# EAGLE design msp430_cool (EAGLE 6.5.0)
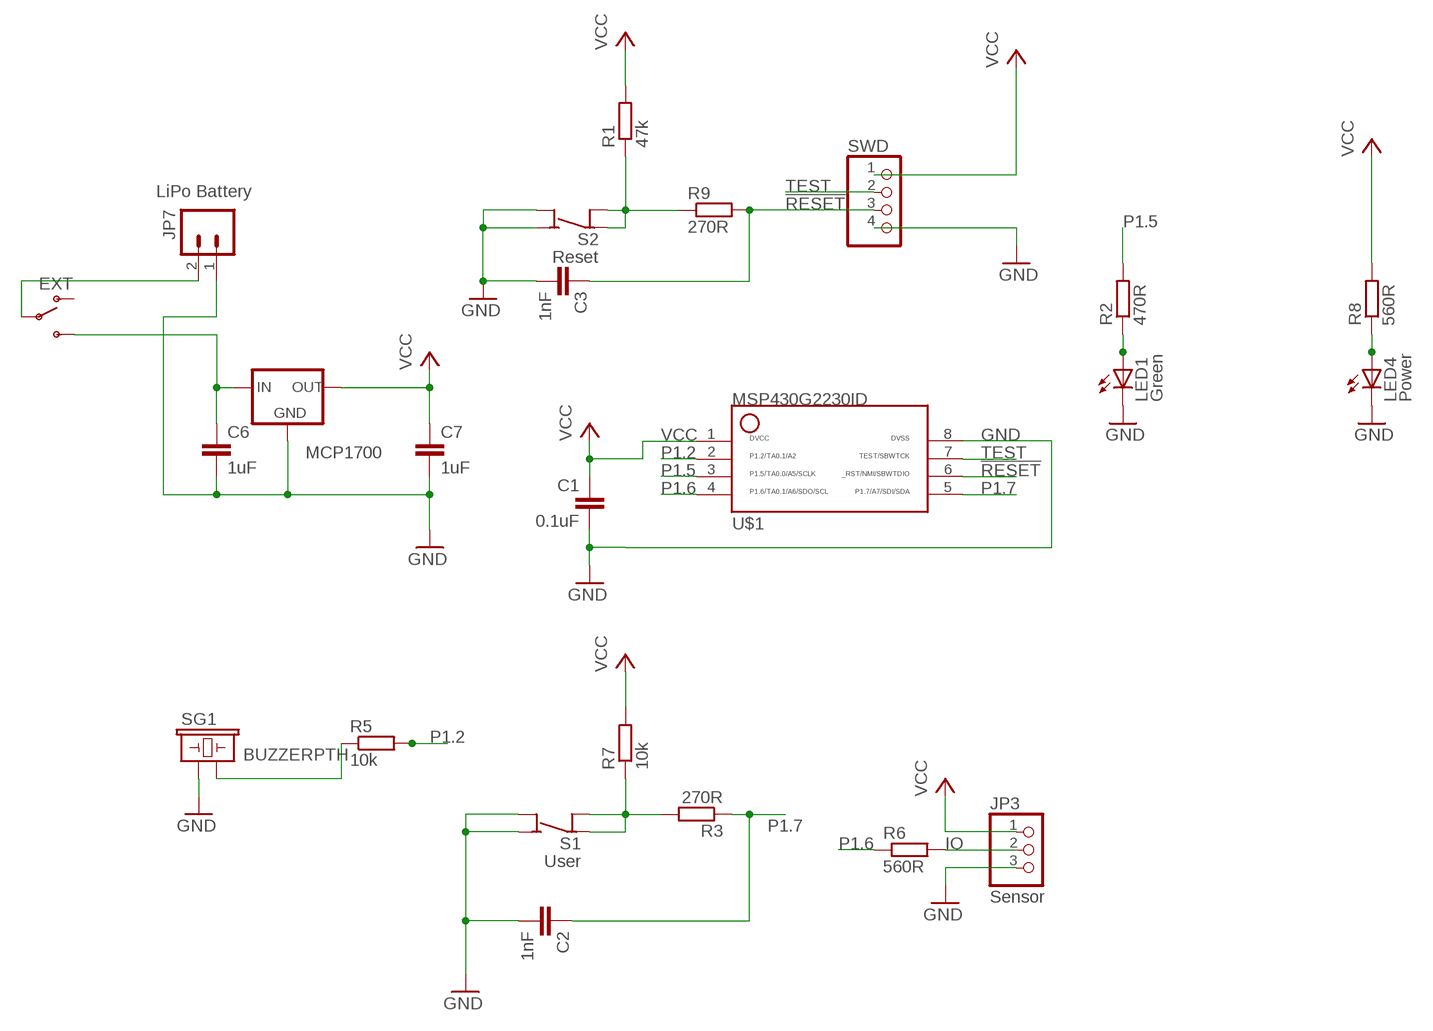
[diagram p0: schematic, sheet 1]

## Parts
C1  0.1uF  C-EUC0805  [C0805]
C2  1nF  C-EUC0805  [C0805]
C3  1nF  C-EUC0805  [C0805]
C6  1uF  C-EUC0805  [C0805]
C7  1uF  C-EUC0805  [C0805]
JP3  Sensor  PINHD-1X3  [1X03]
JP7  LiPo Battery  M02JST-PTH-2  [JST-2-PTH]
LED1  Green  LEDCHIPLED_1206  [CHIPLED_1206]
LED4  Power  LEDCHIPLED_1206  [CHIPLED_1206]
MCP1700  MCP1700  MCP1700SOT-23  [SOT-23]
ON  EXT  SWITCH-SPSTPTH  [SWITCH-SPDT]
R1  47k  R-EU_R0805  [R0805]
R2  470R  R-EU_R0805  [R0805]
R3  270R  R-EU_R0805  [R0805]
R5  10k  R-EU_R0805  [R0805]
R6  560R  R-EU_R0805  [R0805]
R7  10k  R-EU_R0805  [R0805]
R8  560R  R-EU_R0805  [R0805]
R9  270R  R-EU_R0805  [R0805]
S1  User  SPST4  [6MMTACTILE_4PIN]
S2  Reset  SPST4  [6MMTACTILE_4PIN]
SG1  BUZZERPTH  [BUZZER-12MM]
SWD  PINHD-1X4  [1X04]
U$1  MSP430G2230ID  [SO08]

## Nets
!RESET: C3.1 R9.2 SWD.3 U$1.6
GND [GND]: C1.2 C2.2 C3.2 C6.2 C7.2 JP3.3 JP7.1 LED1.C LED4.C MCP1700.1(GND) S1.A1(NO) S1.A2(NO) S2.A1(NO) S2.A2(NO) SG1.+ SWD.4 U$1.8
IO: JP3.2 R6.2
N$2: LED4.A R8.1
N$3 [VCC]: JP7.2 ON.2(P)
N$4: LED1.A R2.1
N$5: R1.1 R9.1 S2.B1(COM) S2.B2(COM)
N$6: R5.1 SG1.-
N$7: R3.2 R7.1 S1.B1(COM) S1.B2(COM)
N$15 [VCC]: C6.1 MCP1700.3(IN) ON.3(S)
P1.2: R5.2 U$1.2
P1.5: R2.2 U$1.3
P1.6: R6.1 U$1.4
P1.7: C2.1 R3.1 U$1.5
TEST: SWD.2 U$1.7
VCC [VCC]: C1.1 C7.1 JP3.1 MCP1700.2(OUT) R1.2 R7.2 R8.2 SWD.1 U$1.1
Unconnected: ON.1(O)

## Library data of the parts
C1-C3 C6 C7 = resistor:C-EU: CAPACITOR, European symbol
JP3 = pinhead:PINHD-1X3: PIN HEADER
JP7 = SparkFun:M02: Header 2 Standard 2-pin 0.1" header. Use with straight break away headers (SKU : PRT-00116), right angle break away headers (PRT-00553), swiss pins (PRT-00743), machine pins (PRT-00117), and female headers (PRT-00115). Molex polarized connector foot print use with SKU : PRT-08233 with associated crimp pins and housings.
LED1 LED4 = adafruit:LED: LED OSRAM: - CHIPLED LG R971, LG N971, LY N971, LG Q971, LY Q971, LO R971, LY R971 LH N974, LH R974 LS Q976, LO Q976, LY Q976 LO Q996 - Hyper CHIPLED LW Q18S LB Q993, LB Q99A, LB R99A - SideLED LS A670, LO A670, LY A670, LG A670, LP A670 LB A673, LV A673, LT A673, LW A673 LH A674 LY A675 LS A676, LA A676, LO A676, LY A676, LW A676 LS A679, LY A679, LG A679 - Hyper Micro SIDELED® LS Y876, LA Y876, LO Y876, LY Y876 LT Y87S - SmartLED LW L88C, LW L88S LB L89C, LB L89S, LG L890 LS L89K, LO L89K, LY L89K LS L896, LA L896, LO L896, LY L896 - TOPLED LS T670, LO T670, LY T670, LG T670, LP T670 LSG T670, LSP T670, LSY T670, LOP T670, LYG T670 LG T671, LOG T671, LSG T671 LB T673, LV T673, LT T673, LW T673 LH T674 LS T676, LA T676, LO T676, LY T676, LB T676, LH T676, LSB T676, LW T676 LB T67C, LV T67C, LT T67C, LS T67K, LO T67K, LY T67K, LW E67C LS E67B, LA E67B, LO E67B, LY E67B, LB E67C, LV E67C, LT E67C LW T67C LS T679, LY T679, LG T679 LS T770, LO T770, LY T770, LG T770, LP T770 LB T773, LV T773, LT T773, LW T773 LH T774 LS E675, LA E675, LY E675, LS T675 LS T776, LA T776, LO T776, LY T776, LB T776 LHGB T686 LT T68C, LB T68C - Hyper Mini TOPLED® LB M676 - Mini TOPLED Santana® LG M470 LS M47K, LO M47K, LY M47K Source: http://www.osram.convergy.de/
MCP1700 = MY_IC:MCP1700
ON = SparkFun:SWITCH-SPST: SPST Switch Simple slide switch. Spark Fun Electronics SKU : COM-00102
R1-R3 R5-R9 = resistor:R-EU_: RESISTOR, European symbol
S1 S2 = mes_electromech:SPST4: SPST switch with 2 pins per contact
SG1 = SparkFun:BUZZER: Buzzer 12mm Spark Fun Electronics SKU : Comp-Buzzer
SWD = pinhead:PINHD-1X4: PIN HEADER
U$1 = thierry_eagle:MSP430G2230ID

## Net classes
0 default: width 0.305 mm, drill 0.508 mm
1 GND: width 0.508 mm, drill 0.508 mm
2 VCC: width 0.508 mm, drill 0.508 mm

## Board
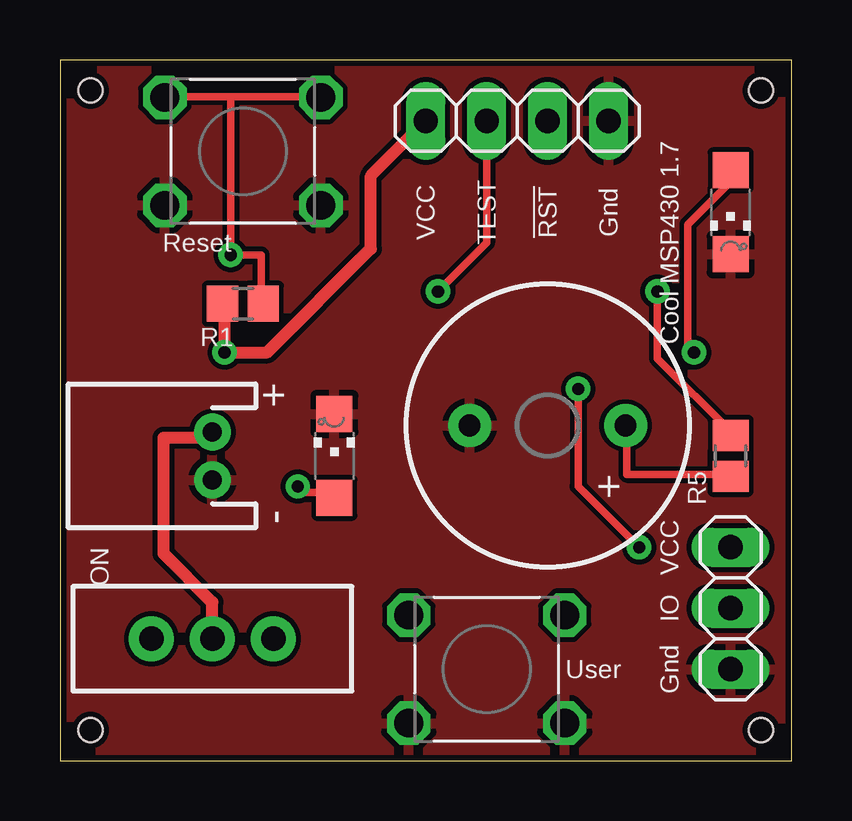
[diagram p1: board, top side]
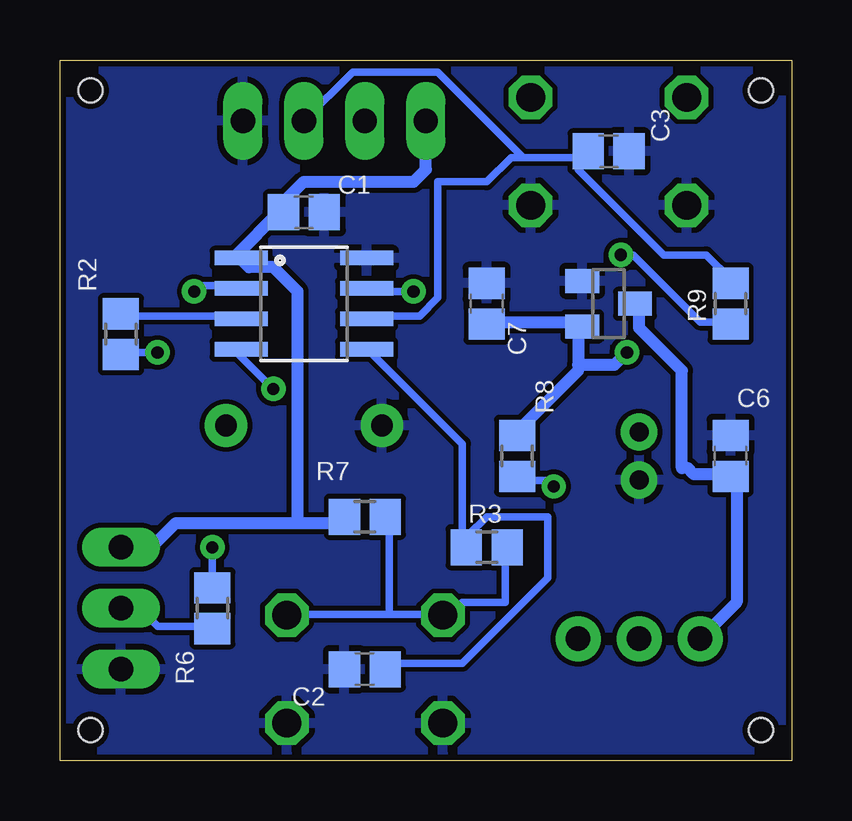
[diagram p2: board, bottom side, seen from below]

Size 30.48 x 29.21 mm. Coordinates in mm from the lower left corner, seen from the top.
Outline: 0,0 30.48,0 30.48,29.21 0,29.21 0,0
Copper layers (1*16): Top 0.035mm / dielectric 1.5mm / Bottom 0.035mm
Design rules "SparkFun *": minimum track width 12mil, minimum drill 20mil, track to track 8mil, track to pad 8mil, pad to pad 8mil, via to via 8mil, smd to smd 8mil, copper to edge 10mil, drill to drill 8mil, minimum pad ring 12mil, minimum via ring 10mil, stop-mask expansion 4mil, vias tented up to drill 25mil, thermal gap 10mil
Holes 1 mm at 1.27,1.27 1.27,27.94 29.21,1.27 29.21,27.94

### Footprints (pad centres in the part's own frame; a part is rotated, then mirrored left to right if it is on the bottom)
C0805 = smd 1.3 x 1.5: 1 -0.85,0; 2 0.85,0
1X03 = drill 1.016 long: 1 -2.54,0; 2 0,0; 3 2.54,0
JST-2-PTH = drill 0.787 pad 1.524: 1 -1,0; 2 1,0
CHIPLED_1206 = smd 1.5 x 1.5: A 0,-1.75; C 0,1.75
SOT-23 = smd 1 x 1.4: 1 -0.95,-1.1; 2 0.95,-1.1; 3 0,1.1
SWITCH-SPDT = drill 1.016 pad 1.88: 1 0,2.54; 2 0,0; 3 0,-2.54
R0805 = smd 1.3 x 1.5: 1 -0.85,0; 2 0.85,0
6MMTACTILE_4PIN = drill 1.2 octagon: A1 3.25,-2.25; A2 -3.25,-2.25; B1 3.25,2.25; B2 -3.25,2.25
BUZZER-12MM = drill 0.9 pad 1.778: + 3.25,0; - -3.25,0
1X04 = drill 1.016 long: 1 -3.81,0; 2 -1.27,0; 3 1.27,0; 4 3.81,0
SO08 = smd 0.61 x 2.21: 1 -1.905,-2.616; 2 -0.635,-2.616; 3 0.635,-2.616; 4 1.905,-2.616; 5 1.905,2.616; 6 0.635,2.616; 7 -0.635,2.616; 8 -1.905,2.616

### Placement (x,y rotation side)
C1  20.32,22.86 0 bottom
C2  17.78,3.81 180 bottom
C3  7.62,25.4 0 bottom
C6  2.54,12.7 90 bottom
C7  12.7,19.05 90 bottom
JP3  27.94,6.35 270 top
JP7  6.35,12.7 90 top
LED1  27.94,22.86 180 top
LED4  11.43,12.7 0 top
MCP1700  7.62,19.05 270 bottom
ON  6.35,5.08 270 top
R1  7.62,19.05 180 top
R2  27.94,17.78 90 bottom
R3  12.7,8.89 0 bottom
R5  27.94,12.7 90 top
R6  24.13,6.35 270 bottom
R7  17.78,10.16 180 bottom
R8  11.43,12.7 90 bottom
R9  2.54,19.05 90 bottom
S1  17.78,3.81 0 top
S2  7.62,25.4 0 top
SG1  20.32,13.97 180 top
SWD  19.05,26.67 0 top
U$1  20.32,19.05 270 bottom

### Tracks (layer width: path | path; a pad name or v marks a point on that pad's centre or on a via)
!RESET
  Bottom 0.305: 8.89,25.15 8.89,25.4 C3.1 8.89,25.15 | 8.89,25.15 8.89,24.64 5.33,21.08 3.56,21.08 2.54,20.07 R9.2 | 8.89,25.15 11.18,25.15 | 11.18,25.15 11.68,25.15 12.7,24.13 14.73,24.13 14.73,19.3 15.49,18.54 17.53,18.54 U$1.6 | SWD.3 18.29,28.7 14.73,28.7 11.18,25.15
GND
  pour Bottom: 0,29.21 30.48,29.21 30.48,0 0,0
  pour Top: 0,29.21 30.48,29.21 30.48,0 0,0
IO
  Bottom 0.305: JP3.2 27.18,6.35 26.42,5.59 24.13,5.59 R6.2
N$2  (via drill 0.51)
  Top 0.305: v9.91,11.43 9.91,11.18 11.43,11.18 LED4.A
  Bottom 0.305: v9.91,11.43 10.16,11.68 11.43,11.68 R8.1
N$3
  Top 0.508: ON.2 6.35,6.6 4.32,8.64 4.32,13.46 6.35,13.46 JP7.2
N$4  (via drill 0.51)
  Top 0.305: v26.42,17.02 26.16,17.27 26.16,22.35 27.94,24.13 LED1.A
  Bottom 0.305: v26.42,17.02 27.94,17.02 R2.1
N$5  (via drill 0.51)
  Top 0.305: R1.1 8.38,19.05 8.38,21.08 v7.11,21.08 7.11,27.69 | 7.11,27.69 10.67,27.69 S2.B1 | 7.11,27.69 4.57,27.69 S2.B2
  Bottom 0.305: v7.11,21.08 6.6,21.08 3.81,18.29 2.54,18.29 R9.1
N$6
  Top 0.305: R5.1 27.94,11.94 23.62,11.94 23.62,13.97 SG1.-
N$7
  Bottom 0.305: R3.2 11.94,8.89 11.94,6.6 13.72,6.6 14.22,6.1 14.48,6.1 S1.B2 14.73,6.1 16.76,6.1 | 16.76,6.1 16.76,10.16 R7.1 | 16.76,6.1 20.83,6.1 S1.B1
N$15
  Bottom 0.508: MCP1700.3 6.35,19.05 6.35,18.03 4.57,16.26 4.57,12.19 4.32,12.19 4.06,11.94 2.54,11.94 C6.1 2.54,11.68 2.29,11.68 2.29,6.6 ON.3
P1.2  (via drill 0.51)
  Top 0.305: v24.89,19.56 24.89,16.76 27.94,13.72 R5.2
  Bottom 0.305: v24.89,19.56 24.64,19.81 23.11,19.81 U$1.2
P1.5
  Bottom 0.305: R2.2 27.94,18.54 23.11,18.54 U$1.3
P1.6  (via drill 0.51)
  Top 0.305: v24.13,8.89 21.59,11.43 v21.59,15.49
  Bottom 0.305: v24.13,8.89 R6.1 | v21.59,15.49 23.11,17.02 U$1.4
P1.7
  Bottom 0.305: 13.46,9.4 12.7,10.16 10.16,10.16 10.16,7.62 13.72,4.06 16.51,4.06 16.76,3.81 C2.1 | 13.46,9.4 13.46,8.89 R3.1 13.46,9.4 | 13.46,9.4 13.72,9.4 13.72,13.21 17.53,17.02 U$1.5
TEST  (via drill 0.51)
  Top 0.305: v15.75,19.56 17.78,21.59 SWD.2
  Bottom 0.305: v15.75,19.56 17.53,19.56 U$1.7
VCC  (via drill 0.51)
  Top 0.508: R1.2 6.86,19.05 v6.86,17.02 8.64,17.02 12.95,21.34 12.95,24.38 SWD.1
  Bottom 0.508: C7.1 12.7,18.29 8.89,18.29 MCP1700.2 8.89,18.03 8.89,16.51 | 8.89,16.51 8.89,16.26 11.43,13.72 R8.2 | v6.86,17.02 7.37,16.51 8.89,16.51 | 20.57,9.91 25.65,9.91 26.67,8.89 JP3.1 | 20.57,9.91 19.05,9.91 18.8,10.16 R7.2 | 20.57,9.91 20.57,19.56 21.59,20.57 22.61,20.57 22.86,20.83 U$1.1 23.11,21.08 21.34,22.86 C1.1 21.59,22.86 20.32,24.13 15.75,24.13 15.24,24.64 SWD.1

### Text on the board
tNames: VCC | TEST | !RST | Gnd | Cool MSP430 1.7 | + | + | - | VCC | IO | Gnd